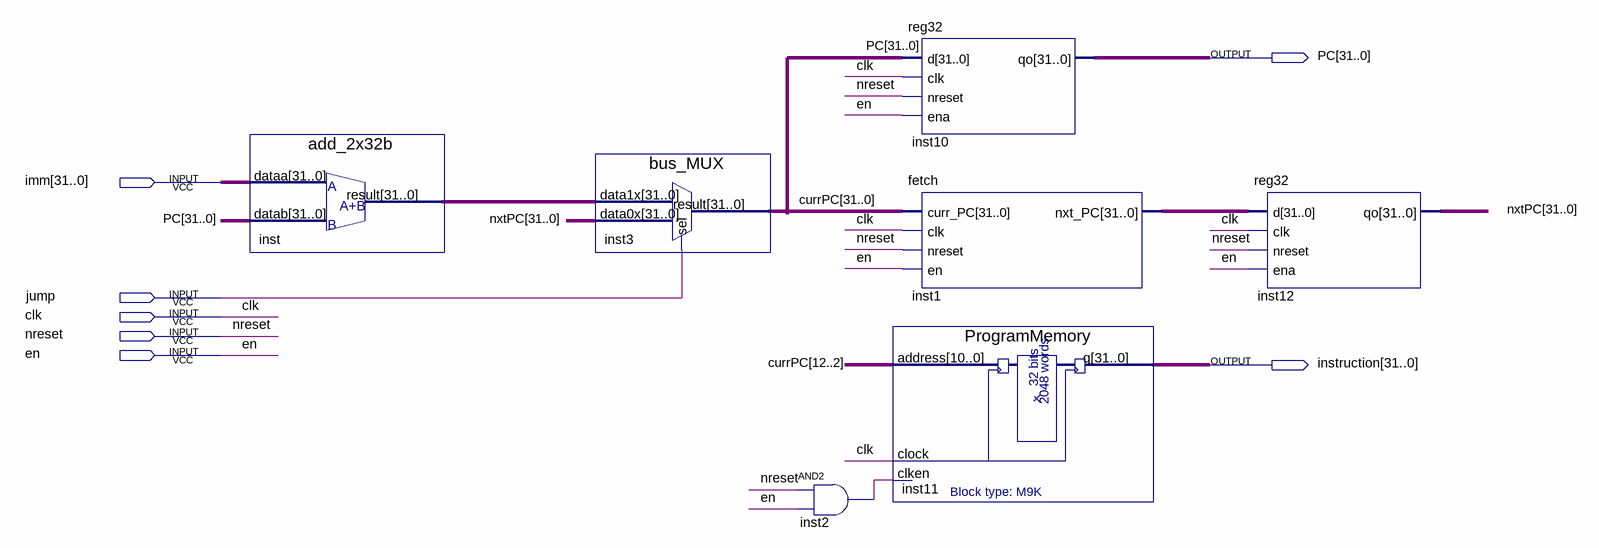
[diagram p0: schematic sheet]
// Quartus schematic IFU.bdf as structural Verilog: 7 symbols, 7 pins
module IFU (
  input  [31:0] imm,
  input  jump,
  input  clk,
  input  nreset,
  input  en,
  output [31:0] PC,
  output [31:0] instruction
);

  wire inst2_out;
  wire [31:0] currPC, inst1_nxt_pc, inst_result, nxtPC;

  add_2x32b inst (.dataa(imm), .datab(PC), .result(inst_result));
  bus_MUX inst3 (.data1x(inst_result), .data0x(nxtPC), .sel(jump), .result(currPC));
  and inst2 (inst2_out, nreset, en);
  reg32 inst10 (.d(currPC), .clk(clk), .nreset(nreset), .ena(en), .qo(PC));
  fetch inst1 (.curr_PC(currPC), .clk(clk), .nreset(nreset), .en(en), .nxt_PC(inst1_nxt_pc));
  ProgramMemory inst11 (.address(currPC[12:2]), .clock(clk), .clken(inst2_out), .q(instruction));
  reg32 inst12 (.d(inst1_nxt_pc), .clk(clk), .nreset(nreset), .ena(en), .qo(nxtPC));
endmodule
